# EAGLE schematic Sheild Generator - Main unit (EAGLE 7.6.0)
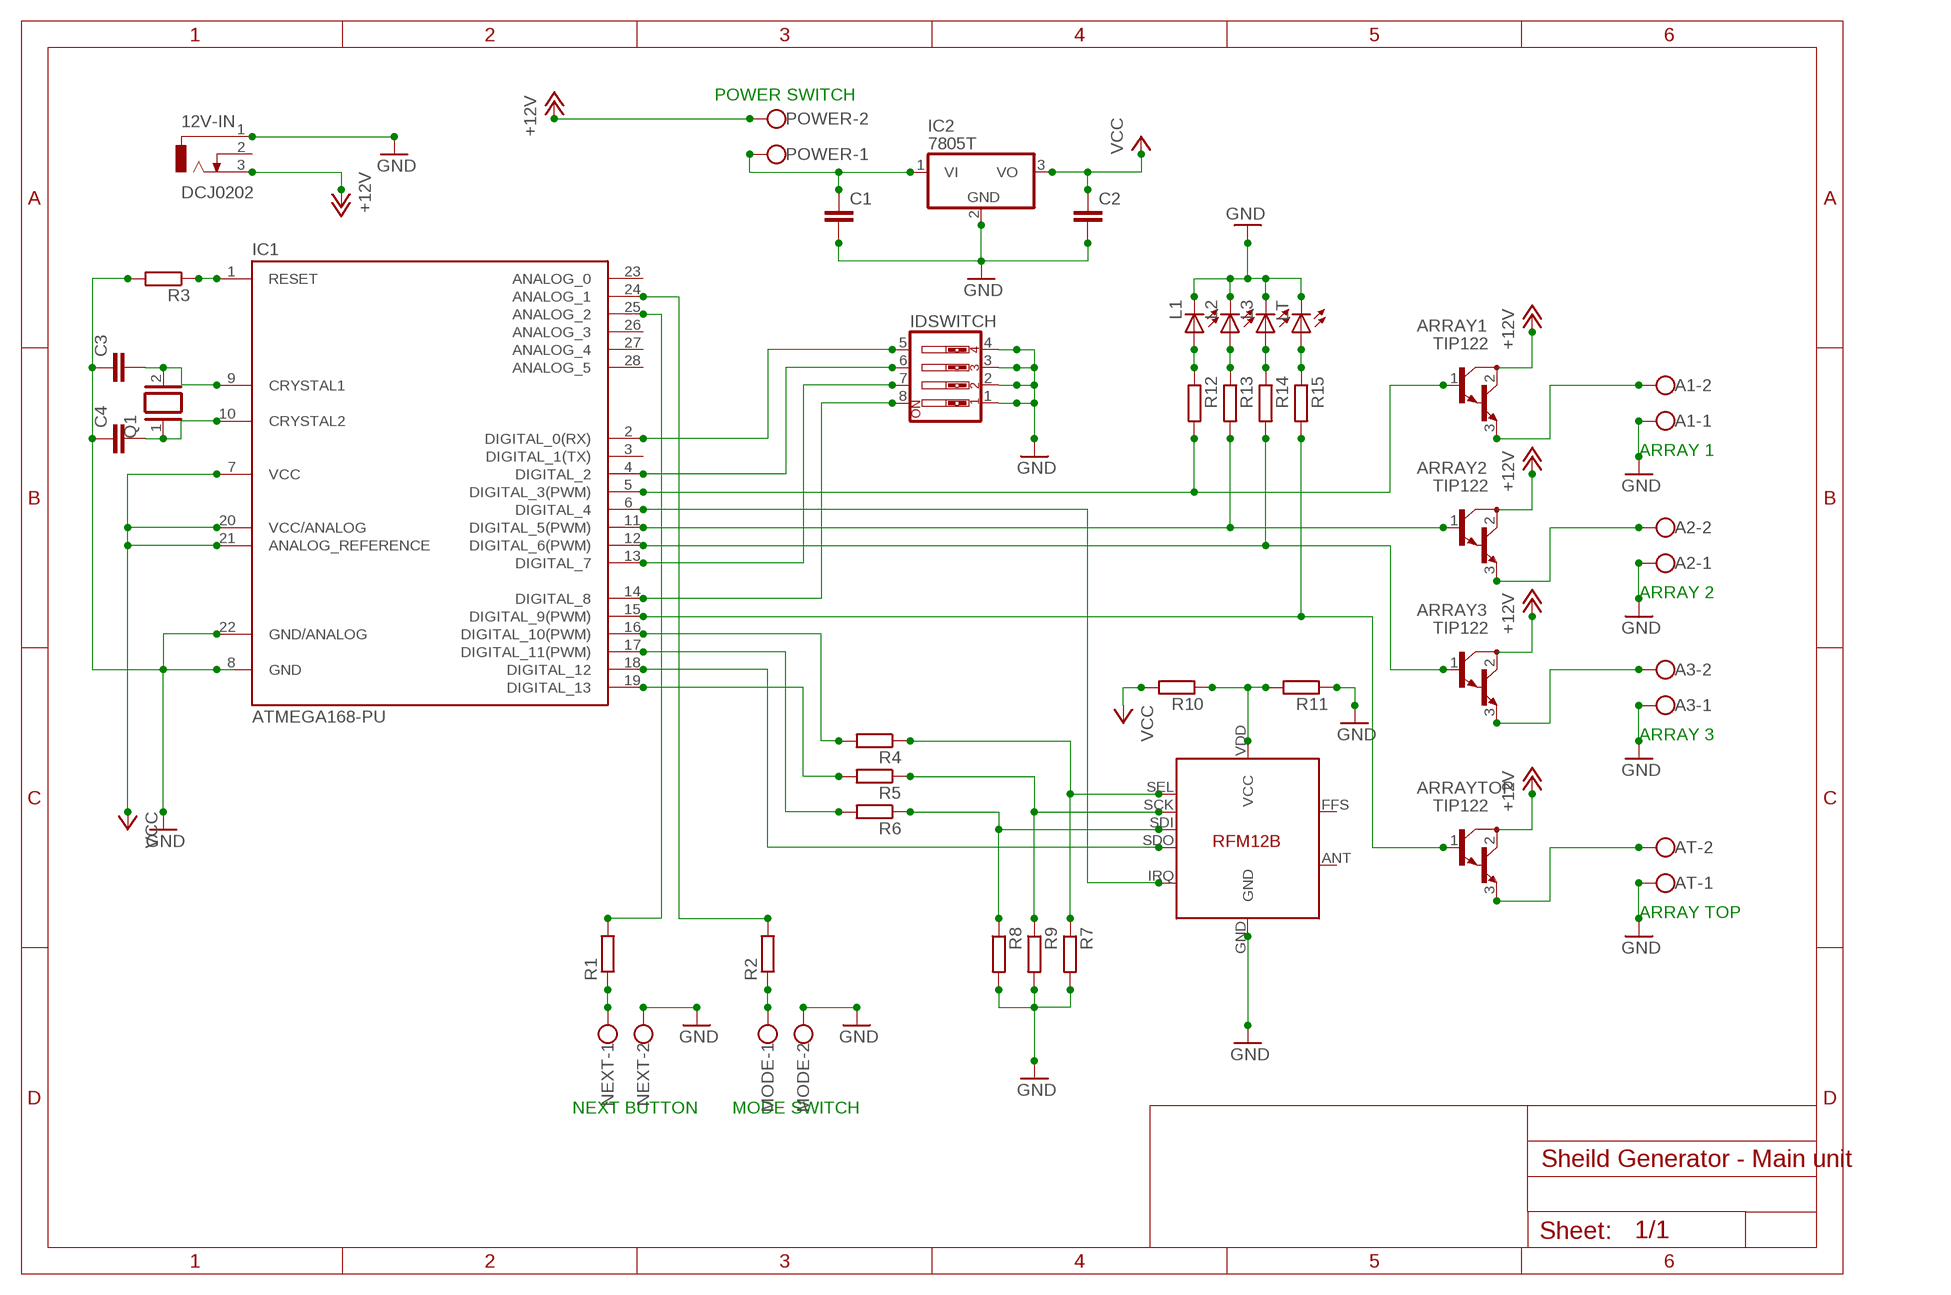
[diagram p0: schematic, sheet 1]

## Parts
12V-IN  DCJ0202  [DCJ0202]
A1  W237-102  [W237-102]
A2  W237-102  [W237-102]
A3  W237-102  [W237-102]
ARRAY1  TIP122  [TO220]
ARRAY2  TIP122  [TO220]
ARRAY3  TIP122  [TO220]
ARRAYTOP  TIP122  [TO220]
AT  W237-102  [W237-102]
C1  C-EU025-024X044  [C025-024X044]
C2  C-EU025-024X044  [C025-024X044]
C3  C-EU025-024X044  [C025-024X044]
C4  C-EU025-024X044  [C025-024X044]
IC1  ATMEGA168-PU  [DIL28-3]
IC2  7805T  [TO220H]
IDSWITCH  SW_DIP-4  [EDG-04]
L1  LED3MM  [LED3MM]
L2  LED3MM  [LED3MM]
L3  LED3MM  [LED3MM]
LT  LED3MM  [LED3MM]
MODE  W237-102  [W237-102]
NEXT  W237-102  [W237-102]
POWER  W237-102  [W237-102]
Q1  XTAL/S  [QS]
R1  R-EU_0204/7  [0204/7]
R2  R-EU_0204/7  [0204/7]
R3  R-EU_0204/7  [0204/7]
R4  R-EU_0204/7  [0204/7]
R5  R-EU_0204/7  [0204/7]
R6  R-EU_0204/7  [0204/7]
R7  R-EU_0204/7  [0204/7]
R8  R-EU_0204/7  [0204/7]
R9  R-EU_0204/7  [0204/7]
R10  R-EU_0204/7  [0204/7]
R11  R-EU_0204/7  [0204/7]
R12  R-EU_0204/7  [0204/7]
R13  R-EU_0204/7  [0204/7]
R14  R-EU_0204/7  [0204/7]
R15  R-EU_0204/7  [0204/7]
U$1  RFM12B  [RFM12B]

## Nets
+12V: 12V-IN.3 ARRAY1.2(C) ARRAY2.2(C) ARRAY3.2(C) ARRAYTOP.2(C) POWER.2
GND: 12V-IN.1 A1.1 A2.1 A3.1 AT.1 C1.2 C2.2 C3.1 C4.1 IC1.8(GND) IC1.22(GND/ANALOG) IC2.2(GND) IDSWITCH.1 IDSWITCH.2 IDSWITCH.3 IDSWITCH.4 L1.K(C) L2.K(C) L3.K(C) LT.K(C) MODE.2 NEXT.2 R3.2 R7.2 R8.2 R9.2 R11.1 U$1.GND
N$1: ARRAY1.1(B) IC1.5(DIGITAL_3(PWM)) R12.2
N$2: ARRAY2.1(B) IC1.11(DIGITAL_5(PWM)) R13.2
N$3: ARRAY3.1(B) IC1.12(DIGITAL_6(PWM)) R14.2
N$4: ARRAYTOP.1(B) IC1.15(DIGITAL_9(PWM)) R15.2
N$5: IC1.2(DIGITAL_0(RX)) IDSWITCH.5
N$6: IC1.4(DIGITAL_2) IDSWITCH.6
N$7: IC1.13(DIGITAL_7) IDSWITCH.7
N$8: IC1.14(DIGITAL_8) IDSWITCH.8
N$9: NEXT.1 R1.1
N$10: IC1.25(ANALOG_2) R1.2
N$11: A1.2 ARRAY1.3(E)
N$12: A2.2 ARRAY2.3(E)
N$13: A3.2 ARRAY3.3(E)
N$14: ARRAYTOP.3(E) AT.2
N$15: IC1.24(ANALOG_1) R2.2
N$16: MODE.1 R2.1
N$17: C3.2 IC1.9(CRYSTAL1) Q1.2
N$18: C1.1 IC2.1(VI) POWER.1
N$19: C4.2 IC1.10(CRYSTAL2) Q1.1
N$20: R4.1 R7.1 U$1.SEL
N$21: IC1.1(RESET) R3.1
N$22: R5.1 R9.1 U$1.SCK
N$23: R6.1 R8.1 U$1.SDI
N$26: IC1.6(DIGITAL_4) U$1.IRQ
N$27: IC1.16(DIGITAL_10(PWM)) R4.2
N$28: IC1.19(DIGITAL_13) R5.2
N$29: IC1.17(DIGITAL_11(PWM)) R6.2
N$30: IC1.18(DIGITAL_12) U$1.SDO
N$31: R10.1 R11.2 U$1.VDD(VCC)
N$33: L1.A R12.1
N$34: L2.A R13.1
N$35: L3.A R14.1
N$36: LT.A R15.1
VCC: C2.1 IC1.7(VCC) IC1.20(VCC/ANALOG) IC1.21(ANALOG_REFERENCE) IC2.3(VO) R10.2
Unconnected: 12V-IN.2 IC1.3(DIGITAL_1(TX)) IC1.23(ANALOG_0) IC1.26(ANALOG_3) IC1.27(ANALOG_4) IC1.28(ANALOG_5) U$1.ANT U$1.FFS

## Notes on the sheet
- POWER SWITCH
- ARRAY 1
- ARRAY 2
- ARRAY 3
- ARRAY TOP
- NEXT BUTTON | MODE SWITCH

## Library data of the parts
12V-IN = con-jack:DCJ0202: DC POWER JACK Source: DCJ0202.pdf; OC_FARNELL: unknown; OC_NEWARK: unknown
A1-A3 AT MODE NEXT POWER = con-wago-500:W237-102: WAGO SCREW CLAMP; MPN: 237-102; OC_FARNELL: unknown; OC_NEWARK: 70K9898
ARRAY1-ARRAY3 ARRAYTOP = transistor:TIP122: NPN BIPOLAR DARLINGTON TRANSISTOR
C1-C4 = rcl:C-EU: CAPACITOR, European symbol
IC1 = Arduino-AVR:ATMEGA168-PU
IC2 = adafruit:78*: Positive VOLTAGE REGULATOR Added bigger pads to the TO-92 package
IDSWITCH = special:SW_DIP-4: DIP SWITCH
L1-L3 LT = led:LED: LED OSRAM: - CHIPLED LG R971, LG N971, LY N971, LG Q971, LY Q971, LO R971, LY R971 LH N974, LH R974 LS Q976, LO Q976, LY Q976 LO Q996 - Hyper CHIPLED LW Q18S LB Q993, LB Q99A, LB R99A - SideLED LS A670, LO A670, LY A670, LG A670, LP A670 LB A673, LV A673, LT A673, LW A673 LH A674 LY A675 LS A676, LA A676, LO A676, LY A676, LW A676 LS A679, LY A679, LG A679 - Hyper Micro SIDELED® LS Y876, LA Y876, LO Y876, LY Y876 LT Y87S - SmartLED LW L88C, LW L88S LB L89C, LB L89S, LG L890 LS L89K, LO L89K, LY L89K LS L896, LA L896, LO L896, LY L896 - TOPLED LS T670, LO T670, LY T670, LG T670, LP T670 LSG T670, LSP T670, LSY T670, LOP T670, LYG T670 LG T671, LOG T671, LSG T671 LB T673, LV T673, LT T673, LW T673 LH T674 LS T676, LA T676, LO T676, LY T676, LB T676, LH T676, LSB T676, LW T676 LB T67C, LV T67C, LT T67C, LS T67K, LO T67K, LY T67K, LW E67C LS E67B, LA E67B, LO E67B, LY E67B, LB E67C, LV E67C, LT E67C LW T67C LS T679, LY T679, LG T679 LS T770, LO T770, LY T770, LG T770, LP T770 LB T773, LV T773, LT T773, LW T773 LH T774 LS E675, LA E675, LY E675, LS T675 LS T776, LA T776, LO T776, LY T776, LB T776 LHGB T686 LT T68C, LB T68C - Hyper Mini TOPLED® LB M676 - Mini TOPLED Santana® LG M470 LS M47K, LO M47K, LY M47K Source: http://www.osram.convergy.de LUXEON: - LUMILED® LXK2-PW12-R00, LXK2-PW12-S00, LXK2-PW14-U00, LXK2-PW14-V00 LXK2-PM12-R00, LXK2-PM12-S00, LXK2-PM14-U00 LXK2-PE12-Q00, LXK2-PE12-R00, LXK2-PE12-S00, LXK2-PE14-T00, LXK2-PE14-U00 LXK2-PB12-K00, LXK2-PB12-L00, LXK2-PB12-M00, LXK2-PB14-N00, LXK2-PB14-P00, LXK2-PB14-Q00 LXK2-PR12-L00, LXK2-PR12-M00, LXK2-PR14-Q00, LXK2-PR14-R00 LXK2-PD12-Q00, LXK2-PD12-R00, LXK2-PD12-S00 LXK2-PH12-R00, LXK2-PH12-S00 LXK2-PL12-P00, LXK2-PL12-Q00, LXK2-PL12-R00 Source: www.luxeon.com KINGBRIGHT: KA-3528ASYC Source: www.kingbright.com
Q1 = special:XTAL/S: CRYSTAL
R1-R15 = resistor:R-EU_: RESISTOR, European symbol
U$1 = JeeParts:RFM12B

## Net classes
1 GND: width 2.032 mm, drill 2.032 mm, clearance 2.032 mm
2 +12V: width 4.064 mm, drill 4.064 mm, clearance 4.064 mm